# Altium schematic sheet MAX232.SchDoc
size 420 x 297 mm; SheetNumber: 10; SheetTotal: 15
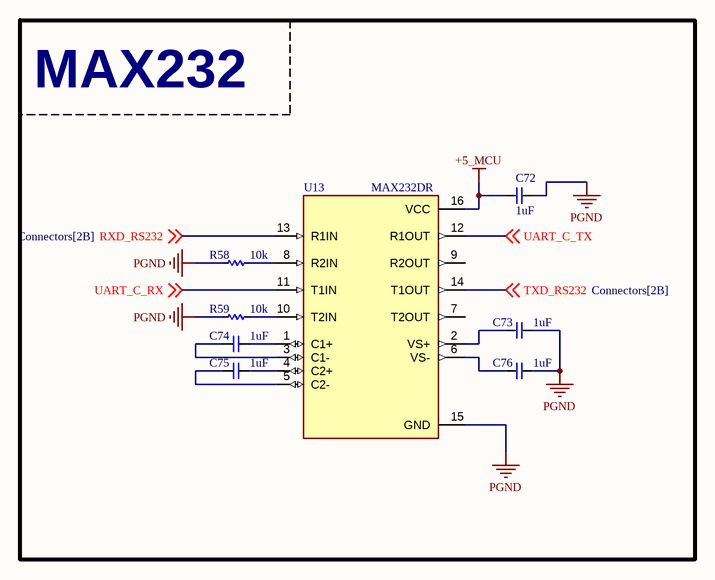
[diagram p0: MAX232.SchDoc]

## Parts
C72  1uF  [CAP_C_1608X80]
C73  1uF  [CAP_C_1608X80]
C74  1uF  [CAP_C_1608X80]
C75  1uF  [CAP_C_1608X80]
C76  1uF  [CAP_C_1608X80]
R58  10k  [RES_C_1608X60]
R59  10k  [RES_C_1608X60]
U13  MAX232DR  [SOIC-16]

## Blocks framed on the sheet
MAX232: C72-C76 R58 R59 U13

## Nets
+5_MCU: C72.2 U13.16(VCC)
PGND: C72.1 C73.1 C76.1 R58.1 R59.1 U13.15(GND)
RXD_RS232: U13.13(R1IN) ; off-sheet RXD_RS232
TXD_RS232: U13.14(T1OUT) ; off-sheet TXD_RS232
UART_C_RX: U13.11(T1IN) ; off-sheet UART_C_RX
UART_C_TX: U13.12(R1OUT) ; off-sheet UART_C_TX
NetC73_2: C73.2 U13.2(VS+)
NetC74_1: C74.1 U13.1(C1+)
NetC74_2: C74.2 U13.3(C1-)
NetC75_1: C75.1 U13.4(C2+)
NetC75_2: C75.2 U13.5(C2-)
NetC76_2: C76.2 U13.6(VS-)
NetR58_2: R58.2 U13.8(R2IN)
NetR59_2: R59.2 U13.10(T2IN)

Not connected (* = marked no-connect by the designer): U13 7(T2OUT) 9(R2OUT)

## Notes on the sheet
- Project:
- DAL_PDU
- Sub-system:
- IGRVT-50
- Design by:
- KIEN HOANG
- BAO BUI
- Sheet title:
- Sheet
- A3
- of
- Checked by:
- Approved by:
- VU PHAM
- Revision:
- Document No:
- Size:
- Date:

## Library data of the parts
C72-C76 = _CAP_C_2: CAP
R58 R59 = _RES_B_2_2: RES